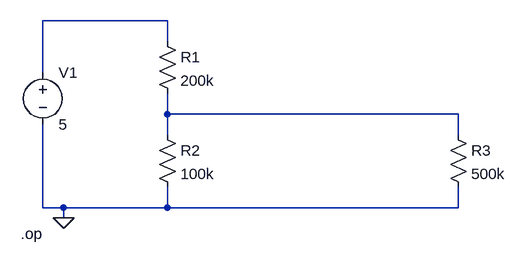
[diagram p0: schematic T4_2_VD.asc]
T4_2_VD.asc, the LTspice schematic file:
Version 4
SHEET 1 880 680
WIRE 288 48 96 48
WIRE 288 80 288 48
WIRE 96 128 96 48
WIRE 288 192 288 160
WIRE 736 192 288 192
WIRE 288 224 288 192
WIRE 736 224 736 192
WIRE 96 336 96 208
WIRE 128 336 96 336
WIRE 288 336 288 304
WIRE 288 336 128 336
WIRE 736 336 736 304
WIRE 736 336 288 336
WIRE 128 352 128 336
FLAG 128 352 0
SYMBOL voltage 96 112 R0
WINDOW 123 0 0 Left 0
WINDOW 39 0 0 Left 0
SYMATTR InstName V1
SYMATTR Value 5
SYMBOL res 272 64 R0
SYMATTR InstName R1
SYMATTR Value 200k
SYMBOL res 272 208 R0
SYMATTR InstName R2
SYMATTR Value 100k
SYMBOL res 720 208 R0
SYMATTR InstName R3
SYMATTR Value 500k
TEXT 62 376 Left 2 !.op

The netlist it stands for:
* T4_2_VD.asc
V1 N001 0 5
R1 N001 N002 200k
R2 N002 0 100k
R3 N002 0 500k
.op
.backanno
.end